# EasyEDA Pro project glimmer.epro, board Inputs
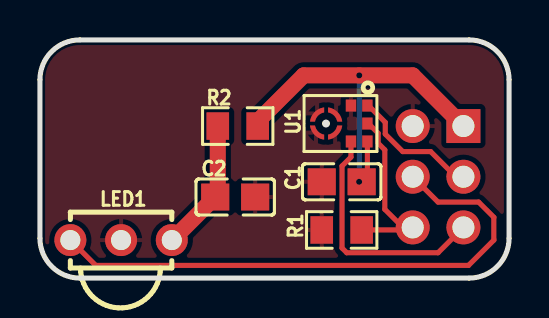
[diagram p2: board, top side]
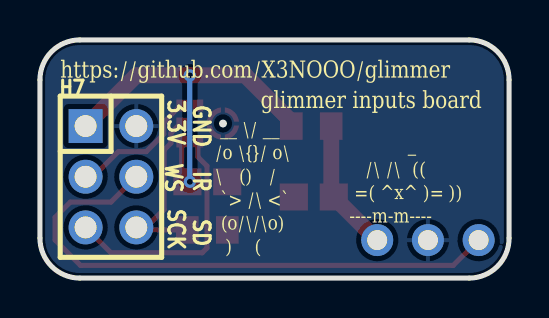
[diagram p3: board, bottom side, seen from below]

Outline 23.5 x 11.94 mm; copper layers: Top Layer, Bottom Layer. Coordinates in mm from the lower left corner of the outline.
Outline path: 0,9.94 0,2 arc(0.59,0.59) 2,0 21.5,0 arc(22.91,0.59) 23.5,2 23.5,9.94 arc(22.91,11.35) 21.5,11.94 2,11.94 arc(0.59,11.35) 0,9.94
Stack: Top Layer 0.035mm / Dielectric1 1.51mm FR4 er 4.5 / Bottom Layer 0.035mm

## Design rules (mm)
template: JLCPCB Capability(Two Layers Board)
spacing copperThickness1oz (default): track to track 0.102, other pairs 0.152 to 0.3
spacing copperThickness2oz: track to track 0.203, other pairs 0.152 to 0.3
track width copperThickness1oz (default): min 0.127, default 0.254, max 2.54
track width copperThickness2oz: min 0.203, default 0.254, max 2.54
differential pair differentialPair (default): width min 0.127, default 0.254, max 2.54; gap min 0.152, default 0.152
via viaSize (default): diameter min 0.5, default 0.61, max 10; hole min 0.3, default 0.305, max 6.3

## Placement (name value [footprint] x y rotation side)
C1  100nF  [C0805]  15.11 4.83 180 top
C2  4.7uF  [C0805]  9.78 4.06 180 top
H7  PZ254V-12-6P  [HDR-TH_6P-P2.54-V-M-R2-C3-S2.54]  19.94 5.08 270 bottom
LED1  TSOP38238  [SENSOR-TG_TSOP38236]  4.06 1.91 0 top
R1  100kΩ  [R0805]  15.11 2.41 180 top
R2  100Ω  [R0805]  9.91 7.62 180 top
U1  ICS-43434  [MIC-SMD_6P-L3.5-W2.7-P0.90-BL]  15.11 7.75 180 top

## Footprints (pads in the part's own frame, mm; a bottom-side part is the same pattern mirrored in y, then rotated)
C0805
  rect 1.41x1.35 smd: 1(-1,0) 2(1,0)
HDR-TH_6P-P2.54-V-M-R2-C3-S2.54
  rect 1.7x1.7 hole 1.1: 1(-2.54,-1.27)
  round 1.7 hole 1.1: 2(-2.54,1.27) 3(0,-1.27) 4(0,1.27) 5(2.54,-1.27) 6(2.54,1.27)
MIC-SMD_6P-L3.5-W2.7-P0.90-BL
  rect 0.52x0.6 smd: 1(-1.286,-0.9) 2(-0.465,-0.9) 4(-0.465,0.9) 5(-1.286,0.9) 6(-1.286,0)
  custom 0.709x0.71 smd: 3(0.276,-0.452) 3(0.329,0.505) 3(1.234,-0.505) 3(1.286,0.452)
R0805
  rect 1.133x1.377 smd: 1(-1,0) 2(1,0)
SENSOR-TG_TSOP38236
  round 1.6 hole 1: 1(-2.54,0) 2(0,0) 3(2.54,0)

## Nets
As in the schematic.

## Via types
v1: diameter 0.61, hole 0.305, Top Layer to Bottom Layer, 2 vias

## Routing (per net, layer and track width the routed paths; a pad name or vN(x,y) marks a point on that pad's centre or on a via; arc(x,y) is an arc through that point)
3.3V: length 20.1
  Top Layer w0.254: v1(15.99,4.83) 16.4,5.24 U1.5
  Top Layer w0.8: R2.1 10.91,7.86 13.21,10.16 v1(15.99,10.16) 18.67,10.16 21.21,7.62
  Bottom Layer w0.254: v1(15.99,10.16) 15.99,4.83 v1(15.99,4.83)
I2S_SCK: length 12.2
  Top Layer w0.254: U1.4 15.58,6.06 15.13,5.62 15.13,1.51 15.37,1.27 19.94,1.27 21.21,2.54
I2S_SD: length 9.1
  Top Layer w0.254: R1.1 18.54,2.41 H7.6 18.18,2.54 17.27,3.45 17.27,6.43 16.94,6.76 16.94,7.26 16.45,7.75 U1.6
I2S_WS: length 6.6
  Top Layer w0.254: 21.21,5.08 21.2,5.07 20.84,5.07 19.57,6.34 18.17,6.34 17.29,7.22 17.29,7.81 16.45,8.65 U1.1
IR_OUT: length 28.3
  Top Layer w0.254: LED1.1 2.79,0.63 21.46,0.63 22.73,1.91 22.73,3.05 21.97,3.81 19.94,3.81 H7.4
$4N1369: length 6.7
  Top Layer w0.8: R2.2 8.91,4.19 C2.2 6.62,1.91 LED1.3

## Copper pours and planes (outline as drawn; the poured copper is in the pictures)
GND on Top Layer: -0.89,12.32 24.77,12.32 24.77,-1.4 -0.89,-1.4
GND on Bottom Layer: -1.14,12.57 24.89,12.57 24.89,-2.03 -1.14,-2.03

## Text on the board
Bottom Silkscreen Layer: GND | IR | SD | 3.3V | SCK | WS | _ / /\ /\  (( / =( ^x^ )= )) / ----m-m---- | __ \/ __ / /o \{}/ o\ / \   ()   / / `> /\ <` / (o/\/\o) / )    ( | glimmer inputs board | https://github.com/X3NOOO/glimmer
